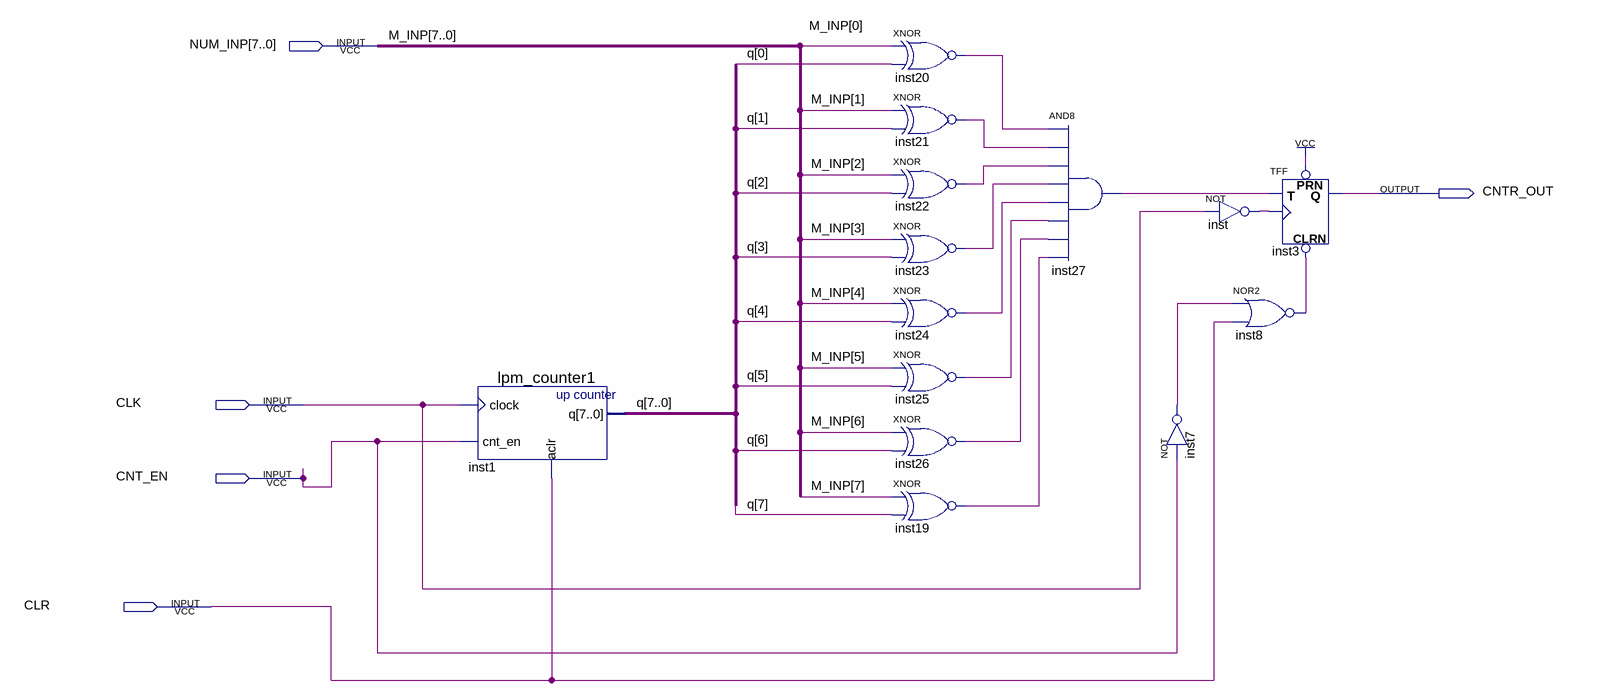
[diagram p0: schematic sheet]
// Quartus schematic BL1.bdf as structural Verilog: 14 symbols, 5 pins
module BL1 (
  input  [7:0] NUM_INP,
  input  CLK,
  input  CNT_EN,
  input  CLR,
  output CNTR_OUT
);

  wire inst7_out, inst8_out, inst19_out, inst20_out, inst21_out, inst22_out, inst23_out, inst24_out,
       inst25_out, inst26_out, inst27_out, inst_out;
  wire [7:0] q;

  lpm_counter1 inst1 (.clock(CLK), .cnt_en(CNT_EN), .aclr(CLR), .q(q));
  xnor inst20 (inst20_out, NUM_INP[0], q[0]);
  xnor inst21 (inst21_out, NUM_INP[1], q[1]);
  xnor inst22 (inst22_out, NUM_INP[2], q[2]);
  xnor inst23 (inst23_out, NUM_INP[3], q[3]);
  xnor inst24 (inst24_out, NUM_INP[4], q[4]);
  xnor inst25 (inst25_out, NUM_INP[5], q[5]);
  xnor inst26 (inst26_out, NUM_INP[6], q[6]);
  xnor inst19 (inst19_out, NUM_INP[7], q[7]);
  and inst27 (inst27_out, inst20_out, inst21_out, inst22_out, inst23_out, inst24_out, inst25_out, inst26_out, inst19_out);
  not inst7 (inst7_out, CNT_EN);
  not inst (inst_out, CLK);
  nor inst8 (inst8_out, inst7_out, CLR);
  TFF inst3 (.PRN(1'b1), .CLRN(inst8_out), .T(inst27_out), .CLK(inst_out), .Q(CNTR_OUT));

  // Other names for the same wires on the sheet: M_INP[7:0] = NUM_INP
endmodule
